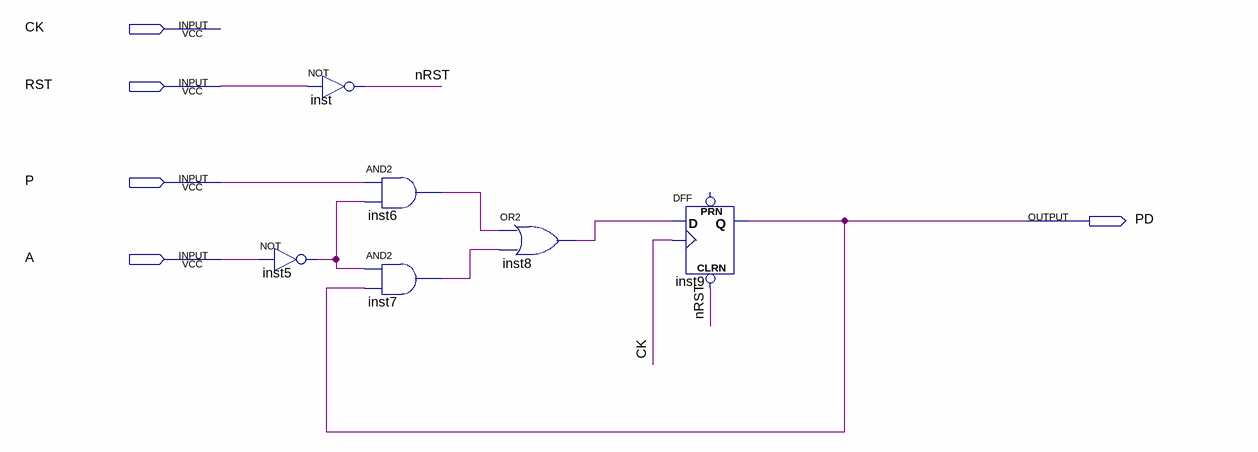
[diagram p0: schematic sheet]
// Quartus schematic Pisos_demanats1bit.bdf as structural Verilog: 6 symbols, 5 pins
module Pisos_demanats1bit (
  input  CK,
  input  RST,
  input  P,
  input  A,
  output PD
);

  wire inst5_out, inst6_out, inst7_out, inst8_out, nRST;

  not inst5 (inst5_out, A);
  not inst (nRST, RST);
  and inst6 (inst6_out, P, inst5_out);
  and inst7 (inst7_out, inst5_out, PD);
  or inst8 (inst8_out, inst6_out, inst7_out);
  DFF inst9 (.CLRN(nRST), .CLK(CK), .D(inst8_out), .Q(PD));  // open: PRN
endmodule
